# Altium schematic sheet eth_lan8742a_phy.SchDoc
size A; SheetNumber: 8
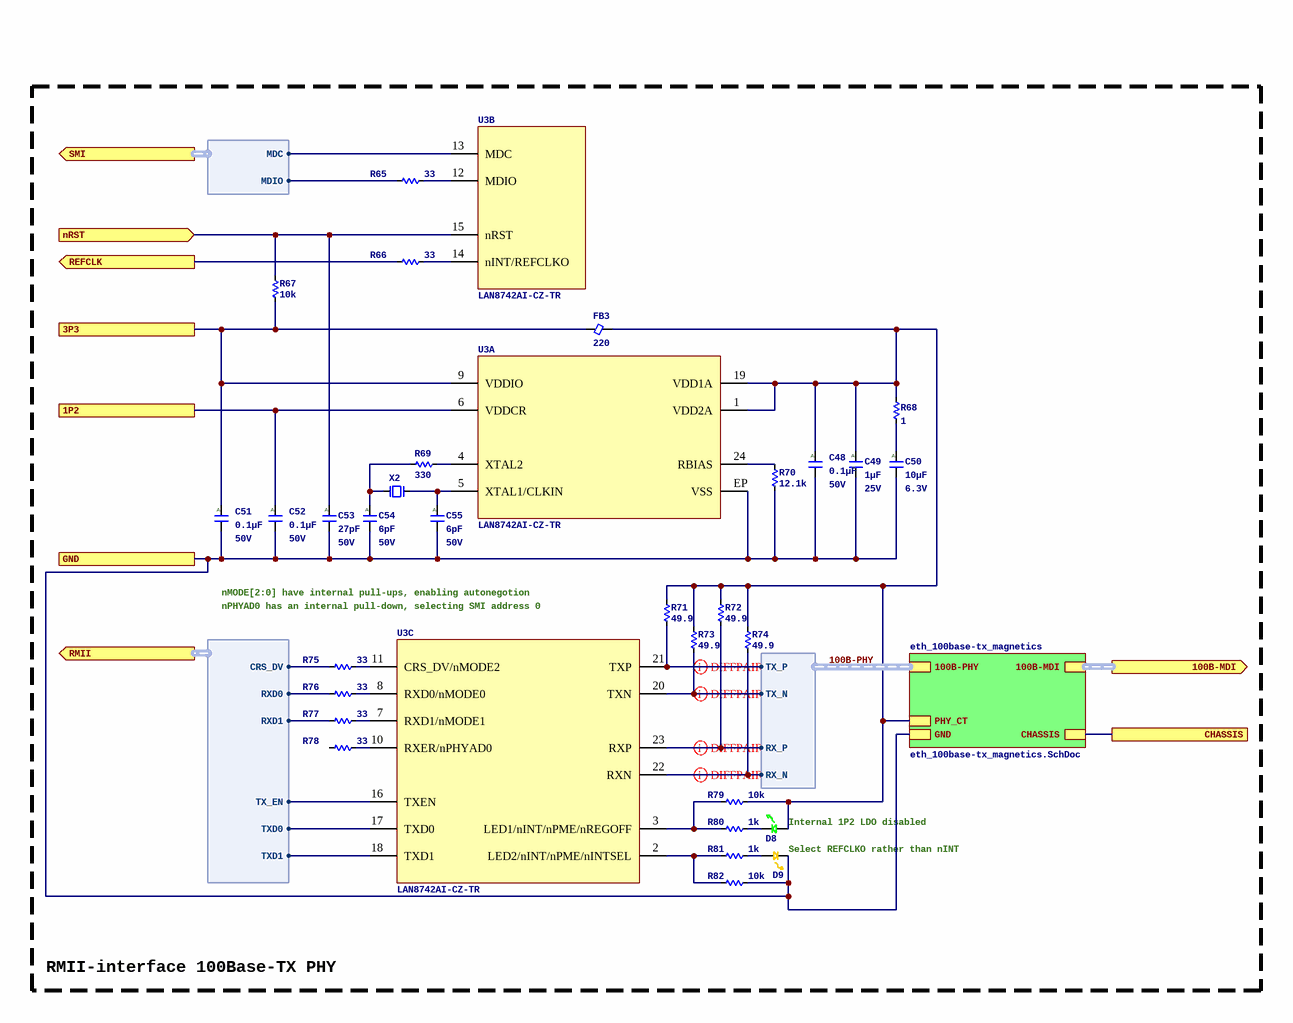
[diagram p0: eth_lan8742a_phy.SchDoc]

## Parts
C48  Capacitance: 0.1µF  Voltage - Rated: 50V  [C0402_0.55MM]  (hidden comment: CGA2B3X7R1H104M050BB)
C49  Capacitance: 1µF  Voltage - Rated: 25V  [C0603_0.80MM]  (hidden comment: CGJ3E1X7R1E105K080AC)
C50  Capacitance: 10µF  Voltage - Rated: 6.3V  [C0805_1.45MM]  (hidden comment: CGA4J1X7R0J106M125AC)
C51  Capacitance: 0.1µF  Voltage - Rated: 50V  [C0402_0.55MM]  (hidden comment: CGA2B3X7R1H104M050BB)
C52  Capacitance: 0.1µF  Voltage - Rated: 50V  [C0402_0.55MM]  (hidden comment: CGA2B3X7R1H104M050BB)
C53  Capacitance: 27pF  Voltage - Rated: 50V  [C0402_0.55MM]  (hidden comment: CGA2B2C0G1H270J050BA)
C54  Capacitance: 6pF  Voltage - Rated: 50V  [C0402_0.55MM]  (hidden comment: CGA2B2C0G1H060D050BA)
C55  Capacitance: 6pF  Voltage - Rated: 50V  [C0402_0.55MM]  (hidden comment: CGA2B2C0G1H060D050BA)
D8  LTST-C190GKT  [LED_0603P_GREEN]  (value not drawn)
D9  LTST-C190AKT  [LED_0603P_AMBER]  (value not drawn)
FB3  Impedance (Ohms @ 100MHz): 220  [FB0402_0.55MM]  (hidden comment: MPZ1005S221ET000)
R65  Resistance: 33  [R0402_0.40MM]  (hidden comment: ERJ-2RKF33R0X)
R66  Resistance: 33  [R0402_0.40MM]  (hidden comment: ERJ-2RKF33R0X)
R67  Resistance: 10k  [R0402_0.40MM]  (hidden comment: ERJ-2RKF1002X)
R68  Resistance: 1  [R0402_0.40MM]  (hidden comment: ERJ-2BQF1R0X)
R69  Resistance: 330  [R0402_0.40MM]  (hidden comment: ERJ-PA2F3300X)
R70  Resistance: 12.1k  [R0402_0.40MM]  (hidden comment: ERJ-2RKF1212X)
R71  Resistance: 49.9  [R0402_0.40MM]  (hidden comment: ERJ-2RKF49R9X)
R72  Resistance: 49.9  [R0402_0.40MM]  (hidden comment: ERJ-2RKF49R9X)
R73  Resistance: 49.9  [R0402_0.40MM]  (hidden comment: ERJ-2RKF49R9X)
R74  Resistance: 49.9  [R0402_0.40MM]  (hidden comment: ERJ-2RKF49R9X)
R75  Resistance: 33  [R0402_0.40MM]  (hidden comment: ERJ-2RKF33R0X)
R76  Resistance: 33  [R0402_0.40MM]  (hidden comment: ERJ-2RKF33R0X)
R77  Resistance: 33  [R0402_0.40MM]  (hidden comment: ERJ-2RKF33R0X)
R78  Resistance: 33  [R0402_0.40MM]  (hidden comment: ERJ-2RKF33R0X)
R79  Resistance: 10k  [R0402_0.40MM]  (hidden comment: ERJ-2RKF1002X)
R80  Resistance: 1k  [R0402_0.40MM]  (hidden comment: ERJ-2RKF1001X)
R81  Resistance: 1k  [R0402_0.40MM]  (hidden comment: ERJ-2RKF1001X)
R82  Resistance: 10k  [R0402_0.40MM]  (hidden comment: ERJ-2RKF1002X)
U3  LAN8742AI-CZ-TR  [24QFN4E]  (parts A,B,C of 3)
X2  XTAL_XRCGB25M000F3A00R0  [4_SMD_2.0X1.6MM]  (value not drawn)

## Sub-sheets
eth_100base-tx_magnetics = eth_100base-tx_magnetics.SchDoc: 100B-PHY (harness 100BASE-TX), GND, CHASSIS, 100B-MDI (harness 100BASE-TX), PHY_CT

## Ports
1P2, 3P3, 100B-MDI (out, harness 100BASE-TX), CHASSIS, GND, nRST (in), REFCLK (out), RMII (out, harness RMII), SMI (out, harness SMI)

## Harnesses
100BASE-TX: RX_N, RX_P, TX_N, TX_P
SMI: MDC, MDIO
RMII: CRS_DV, RXD0, RXD1, TX_EN, TXD0, TXD1

## Nets
1P2: C52.1 U3.6(VDDCR) ; port 1P2
3P3: C51.1 FB3.1 R67.1 U3.9(VDDIO) ; port 3P3
100B-PHY.RX_N: R74.2 U3.22(RXN) ; sheet eth_100base-tx_magnetics/100B-PHY.RX_N
100B-PHY.RX_P: R72.2 U3.23(RXP) ; sheet eth_100base-tx_magnetics/100B-PHY.RX_P
100B-PHY.TX_N: R73.2 U3.20(TXN) ; sheet eth_100base-tx_magnetics/100B-PHY.TX_N
100B-PHY.TX_P: R71.2 U3.21(TXP) ; sheet eth_100base-tx_magnetics/100B-PHY.TX_P
CHASSIS: port CHASSIS, sheet eth_100base-tx_magnetics/CHASSIS
GND: C48.2 C49.2 C50.2 C51.2 C52.2 C53.2 C54.2 C55.2 D9.1 R70.2 R82.2 U3.EP(VSS) ; port GND, sheet eth_100base-tx_magnetics/GND
nRST: C53.1 R67.2 U3.15(nRST) ; port nRST
REFCLK: R66.2 ; port REFCLK
NetC48_1: C48.1 C49.1 D8.2 FB3.2 R68.2 R71.1 R72.1 R73.1 R74.1 R79.2 U3.1(VDD2A) U3.19(VDD1A) ; sheet eth_100base-tx_magnetics/PHY_CT
NetC50_1: C50.1 R68.1
NetC54_1: C54.1 R69.1 X2.3
NetC55_1: C55.1 U3.5(XTAL1/CLKIN) X2.1
NetD8_1: D8.1 R80.1
NetD9_2: D9.2 R81.1
NetR65_1: R65.1 U3.12(MDIO)
NetR65_2: R65.2 ; port SMI.MDIO
NetR66_1: R66.1 U3.14(nINT/REFCLKO)
NetR69_2: R69.2 U3.4(XTAL2)
NetR70_1: R70.1 U3.24(RBIAS)
NetR75_1: R75.1 U3.11(CRS_DV/nMODE2)
NetR75_2: R75.2 ; port RMII.CRS_DV
NetR76_1: R76.1 U3.8(RXD0/nMODE0)
NetR76_2: R76.2 ; port RMII.RXD0
NetR77_1: R77.1 U3.7(RXD1/nMODE1)
NetR77_2: R77.2 ; port RMII.RXD1
NetR78_1: R78.1 U3.10(RXER/nPHYAD0)
NetR79_1: R79.1 R80.2 U3.3(LED1/nINT/nPME/nREGOFF)
NetR81_2: R81.2 R82.1 U3.2(LED2/nINT/nPME/nINTSEL)
NetU3_13: U3.13(MDC) ; port SMI.MDC
NetU3_16: U3.16(TXEN) ; port RMII.TX_EN
NetU3_17: U3.17(TXD0) ; port RMII.TXD0
NetU3_18: U3.18(TXD1) ; port RMII.TXD1

Not connected (* = marked no-connect by the designer): R78 2

## Buses and harness runs
harness 100B-PHY = sheet eth_100base-tx_magnetics/100B-PHY
harness port 100B-MDI = sheet eth_100base-tx_magnetics/100B-MDI

## Layout directives
differential pair; differential pair class DE_100: 100B-PHY.RX_N, 100B-PHY.RX_P, 100B-PHY.TX_N, 100B-PHY.TX_P

## Notes on the sheet
- nMODE[2:0] have internal pull-ups, enabling autonegotion
- nPHYAD0 has an internal pull-down, selecting SMI address 0
- (near D8) Internal 1P2 LDO disabled
- Select REFCLKO rather than nINT
- RMII-interface 100Base-TX PHY
- (in symbol CGA2B2C0G1H060D050BA) A
- (in symbol CGA2B2C0G1H270J050BA) A
- (in symbol CGA2B3X7R1H104M050BB) A
- (in symbol CGA4J1X7R0J106M125AC) A
- (in symbol CGJ3E1X7R1E105K080AC) A

## Library data of the parts
C48 C51 C52 = CGA2B3X7R1H104M050BB: CAP CER 0.1UF 50V X7R 0402; Manufacturer: TDK Corporation; Unit Price (USD): 0.17; Tolerance: ±20%; ComponentLink1URL: https://product.tdk.com/info/en/catalog/datasheets/mlcc_automotive_general_en.pdf?ref_disty=digikey; ComponentLink1Description: Series Datasheet; Series: CGA; Part Status: Active; Temperature Coefficient: X7R; Operating Temperature: -55°C ~ 125°C; Applications: AEC-Q200; Mounting Type: Surface Mount, MLCC; Package / Case: 0402 (1005 Metric); Size / Dimension: 0.039" L x 0.020" W (1.00mm x 0.50mm); Thickness (Max): 0.022" (0.55mm); Supplier 1: Digikey; Supplier Part Number 1: 445-12271-1-ND; Manufacturer Part Number: CGA2B3X7R1H104M050BB
C49 = CGJ3E1X7R1E105K080AC: CAP CER 1UF 25V X7R 0603; Manufacturer: TDK Corporation; Unit Price (USD): 0.55; Tolerance: ±10%; ComponentLink1URL: https://product.tdk.com/info/en/catalog/datasheets/mlcc_highreliability_general_en.pdf?ref_disty=digikey; ComponentLink1Description: Series Datasheet; Series: CGJ; Part Status: Active; Temperature Coefficient: X7R; Operating Temperature: -55°C ~ 125°C; Applications: AEC-Q200; Mounting Type: Surface Mount, MLCC; Package / Case: 0603 (1608 Metric); Size / Dimension: 0.063" L x 0.031" W (1.60mm x 0.80mm); Thickness (Max): 0.031" (0.80mm); Supplier 1: Digikey; Supplier Part Number 1: 445-13311-1-ND; Manufacturer Part Number: CGJ3E1X7R1E105K080AC
C50 = CGA4J1X7R0J106M125AC: CAP CER 10UF 6.3V X7R 0805; Manufacturer: TDK Corporation; Unit Price (USD): 0.43; Tolerance: ±20%; ComponentLink1URL: https://product.tdk.com/info/en/catalog/datasheets/mlcc_automotive_general_en.pdf?ref_disty=digikey; ComponentLink1Description: Series Datasheet; Series: CGA; Part Status: Active; Temperature Coefficient: X7R; Operating Temperature: -55°C ~ 125°C; Applications: AEC-Q200; Mounting Type: Surface Mount, MLCC; Package / Case: 0805 (2012 Metric); Size / Dimension: 0.079" L x 0.049" W (2.00mm x 1.25mm); Thickness (Max): 0.057" (1.45mm); Supplier 1: Digikey; Supplier Part Number 1: 445-12776-1-ND; Manufacturer Part Number: CGA4J1X7R0J106M125AC
C53 = CGA2B2C0G1H270J050BA: CAP CER 27PF 50V C0G 0402; Manufacturer: TDK Corporation; Unit Price (USD): 0.1; Tolerance: ±5%; Temperature Coefficient: C0G, NP0; ComponentLink1URL: https://product.tdk.com/info/en/catalog/datasheets/mlcc_automotive_general_en.pdf?ref_disty=digikey; ComponentLink1Description: Series Datasheet; Supplier 1: Digikey; Supplier Part Number 1: 445-5589-1-ND; Series: CGA; Part Status: Active; Operating Temperature: -55°C ~ 125°C; Applications: AEC-Q200; Mounting Type: Surface Mount, MLCC; Package / Case: 0402 (1005 Metric); Size / Dimension: 0.039" L x 0.020" W (1.00mm x 0.50mm); Thickness (Max): 0.022" (0.55mm); Manufacturer Part Number: CGA2B2C0G1H270J050BA
C54 C55 = CGA2B2C0G1H060D050BA: CAP CER 6PF 50V C0G 0402; Manufacturer: TDK Corporation; Unit Price (USD): 0.1; Tolerance: ±0.5pF; Temperature Coefficient: C0G, NP0; ComponentLink1URL: https://product.tdk.com/info/en/catalog/datasheets/mlcc_automotive_general_en.pdf?ref_disty=digikey; ComponentLink1Description: Series Datasheet; Supplier 1: Digikey; Supplier Part Number 1: 445-5579-1-ND; Series: CGA; Part Status: Active; Operating Temperature: -55°C ~ 125°C; Applications: AEC-Q200; Mounting Type: Surface Mount, MLCC; Package / Case: 0402 (1005 Metric); Size / Dimension: 0.039" L x 0.020" W (1.00mm x 0.50mm); Thickness (Max): 0.022" (0.55mm); Manufacturer Part Number: CGA2B2C0G1H060D050BA
D8 = LED_0603_GREEN_LTST-C190GKT: LED GREEN CLEAR 0603 SMD; Manufacturer: Lite-On Inc; Supplier 1: Digikey; ComponentLink1URL: https://mm.digikey.com/Volume0/opasdata/d220001/medias/docus/858/LTST-C190GKT.pdf; ComponentLink1Description: Datasheet; Supplier Part Number 1: 160-1183-1-ND; Manufacturer Part Number: LTST-C190GKT; Supplier 2: LCSC; Supplier Part Number 2: C125093
D9 = LED_0603_AMBER_LTST-C190AKT: LED AMBER CLEAR 0603 SMD; Manufacturer: Lite-On Inc; Supplier 1: Digikey; ComponentLink1URL: https://mm.digikey.com/Volume0/opasdata/d220001/medias/docus/1139/LTST-C190AKT.pdf; ComponentLink1Description: Datasheet; Supplier Part Number 1: 160-1180-1-ND; Manufacturer Part Number: LTST-C190AKT; Supplier 2: LCSC; Supplier Part Number 2: C6085129
FB3 = MPZ1005S221ET000: FERRITE BEAD 220 OHM 0402 1LN; Manufacturer: TDK Corporation; Filter Type: Power Line; Current Rating (Max): 900mA; DC Resistance (DCR) (Max): 220mOhm; ComponentLink1URL: https://product.tdk.com/info/en/catalog/datasheets/beads_commercial_power_mpz1005-e_en.pdf?ref_disty=digikey; ComponentLink1Description: Datasheet; Series: MPZ-E; Part Status: Active; Operating Temperature: -55°C ~ 125°C; Package / Case: 0402 (1005 Metric); Mounting Type: Surface Mount; Height (Max): 0.022" (0.55mm); Size / Dimension: 0.039" L x 0.020" W (1.00mm x 0.50mm); Supplier Part Number 1: 445-9329-1-ND; Supplier 1: Digikey; Manufacturer Part Number: MPZ1005S221ET000
R65 R66 R75-R78 = ERJ-2RKF33R0X: RES SMD 33 OHM 1% 1/10W 0402; Manufacturer: Panasonic Electronic Components; Unit Price (USD): 0.1; Power (Watts): 0.1W, 1/10W; Temperature Coefficient: ±100ppm/°C; ComponentLink1Description: Datasheet; ComponentLink1URL: https://industrial.panasonic.com/cdbs/www-data/pdf/RDA0000/AOA0000C304.pdf; Series: ERJ; Tolerance: ±1%; Composition: Thick Film; Features: Automotive AEC-Q200; Operating Temperature: -55°C ~ 155°C; Package / Case: 0402 (1005 Metric); Supplier Device Package: 0402; Size / Dimension: 0.039" L x 0.020" W (1.00mm x 0.50mm); Height - Seated (Max): 0.016" (0.40mm); Supplier 1: Digikey; Supplier Part Number 1: P33.0LCT-ND; Manufacturer Part Number: ERJ-2RKF33R0X
R67 R79 R82 = ERJ-2RKF1002X: RES SMD 10K OHM 1% 1/10W 0402; Manufacturer: Panasonic Electronic Components; Unit Price (USD): 0.1; Power (Watts): 0.1W, 1/10W; Temperature Coefficient: ±100ppm/°C; ComponentLink1Description: Datasheet; ComponentLink1URL: https://industrial.panasonic.com/cdbs/www-data/pdf/RDA0000/AOA0000C304.pdf; Series: ERJ; Tolerance: ±1%; Composition: Thick Film; Features: Automotive AEC-Q200; Operating Temperature: -55°C ~ 155°C; Package / Case: 0402 (1005 Metric); Supplier Device Package: 0402; Size / Dimension: 0.039" L x 0.020" W (1.00mm x 0.50mm); Height - Seated (Max): 0.016" (0.40mm); Supplier 1: Digikey; Supplier Part Number 1: P10.0KLCT-ND; Manufacturer Part Number: ERJ-2RKF1002X
R68 = ERJ-2BQF1R0X: RES SMD 1 OHM 1% 1/6W 0402; Manufacturer: Panasonic Electronic Components; Unit Price (USD): 0.41; Power (Watts): 0.167W, 1/6W; Temperature Coefficient: ±250ppm/°C; ComponentLink1Description: Datasheet; ComponentLink1URL: https://industrial.panasonic.com/cdbs/www-data/pdf/RDN0000/AOA0000C313.pdf; Series: ERJ; Tolerance: ±1%; Composition: Thick Film; Features: Automotive AEC-Q200, Current Sense; Operating Temperature: -55°C ~ 125°C; Package / Case: 0402 (1005 Metric); Supplier Device Package: 0402; Size / Dimension: 0.039" L x 0.020" W (1.00mm x 0.50mm); Height - Seated (Max): 0.016" (0.40mm); Supplier 1: Digikey; Supplier Part Number 1: P17252CT-ND; Manufacturer Part Number: ERJ-2BQF1R0X
R69 = ERJ-PA2F3300X: RES SMD 330 OHM 1% 1/5W 0402; Manufacturer: Panasonic Electronic Components; Unit Price (USD): 0.21; Power (Watts): 0.2W, 1/5W; Temperature Coefficient: ±100ppm/°C; ComponentLink1Description: Datasheet; ComponentLink1URL: https://industrial.panasonic.com/cdbs/www-data/pdf/RDO0000/AOA0000C331.pdf; Series: ERJ; Tolerance: ±1%; Composition: Thick Film; Features: Automotive AEC-Q200, Pulse Withstanding; Operating Temperature: -55°C ~ 155°C; Package / Case: 0402 (1005 Metric); Supplier Device Package: 0402; Size / Dimension: 0.039" L x 0.020" W (1.00mm x 0.50mm); Height - Seated (Max): 0.016" (0.40mm); Supplier 1: Digikey; Supplier Part Number 1: P17221CT-ND; Manufacturer Part Number: ERJ-PA2F3300X
R70 = ERJ-2RKF1212X: RES SMD 12.1K OHM 1% 1/10W 0402; Manufacturer: Panasonic Electronic Components; Unit Price (USD): 0.1; Power (Watts): 0.1W, 1/10W; Temperature Coefficient: ±100ppm/°C; ComponentLink1Description: Datasheet; ComponentLink1URL: https://industrial.panasonic.com/cdbs/www-data/pdf/RDA0000/AOA0000C304.pdf; Series: ERJ; Tolerance: ±1%; Composition: Thick Film; Features: Automotive AEC-Q200; Operating Temperature: -55°C ~ 155°C; Package / Case: 0402 (1005 Metric); Supplier Device Package: 0402; Size / Dimension: 0.039" L x 0.020" W (1.00mm x 0.50mm); Height - Seated (Max): 0.016" (0.40mm); Supplier 1: Digikey; Supplier Part Number 1: P12.1KLCT-ND; Manufacturer Part Number: ERJ-2RKF1212X
R71-R74 = ERJ-2RKF49R9X: RES SMD 49.9 OHM 1% 1/10W 0402; Manufacturer: Panasonic Electronic Components; Unit Price (USD): 0.1; Power (Watts): 0.1W, 1/10W; Temperature Coefficient: ±100ppm/°C; ComponentLink1Description: Datasheet; ComponentLink1URL: https://industrial.panasonic.com/cdbs/www-data/pdf/RDA0000/AOA0000C304.pdf; Series: ERJ; Tolerance: ±1%; Composition: Thick Film; Features: Automotive AEC-Q200; Operating Temperature: -55°C ~ 155°C; Package / Case: 0402 (1005 Metric); Supplier Device Package: 0402; Size / Dimension: 0.039" L x 0.020" W (1.00mm x 0.50mm); Height - Seated (Max): 0.016" (0.40mm); Supplier 1: Digikey; Supplier Part Number 1: P49.9LCT-ND; Manufacturer Part Number: ERJ-2RKF49R9X
R80 R81 = ERJ-2RKF1001X: RES SMD 1K OHM 1% 1/10W 0402; Manufacturer: Panasonic Electronic Components; Unit Price (USD): 0.1; Power (Watts): 0.1W, 1/10W; Temperature Coefficient: ±100ppm/°C; ComponentLink1Description: Datasheet; ComponentLink1URL: https://industrial.panasonic.com/cdbs/www-data/pdf/RDA0000/AOA0000C304.pdf; Series: ERJ; Tolerance: ±1%; Composition: Thick Film; Features: Automotive AEC-Q200; Operating Temperature: -55°C ~ 155°C; Package / Case: 0402 (1005 Metric); Supplier Device Package: 0402; Size / Dimension: 0.039" L x 0.020" W (1.00mm x 0.50mm); Height - Seated (Max): 0.016" (0.40mm); Supplier 1: Digikey; Supplier Part Number 1: P1.00KLCT-ND; Manufacturer Part Number: ERJ-2RKF1001X
U3 = ETH_PHY_LAN8742AI: Ethernet Transceiver, PQCC24; Manufacturer: Microchip; Supplier 1: Digikey; Supplier Part Number 1: LAN8742AI-CZ-CT-ND; Manufacturer Part Number: LAN8742AI-CZ-TR; ComponentLink1URL: https://ww1.microchip.com/downloads/aemDocuments/documents/OTH/ProductDocuments/DataSheets/8742a.pdf; ComponentLink1Description: Datasheet; Supplier 2: LCSC; Supplier Part Number 2: C153279
X2 = XTAL_XRCGB25M000F3A00R0: CRYSTAL 25.000MHZ 6PF SMD; Manufacturer: Murata; Supplier 1: Digikey; Supplier Part Number 1: 490-12146-2-ND; Manufacturer Part Number: XRCGB25M000F3A00R0; ComponentLink1Description: Datasheet; ComponentLink1URL: https://www.murata.com/products/productdata/8801076543518/SPEC-XRCGB25M000F3A00R0.pdf; Supplier 2: LCSC; Supplier Part Number 2: C467842